# Altium schematic sheet UI_Panel.SchDoc: UI面板
size 297 x 210 mm; Date: 2025/07/10; Author: Leon Lee; CompanyName: 华南理工大学; Organization: 华南理工大学; Address1: 五山路381号; Address2: 天河区，广州市; Address3: 广东省; DocumentNumber: IH2500-08-02; Revision: 1.0; SheetNumber: 2; SheetTotal: 1; Project: IH2500
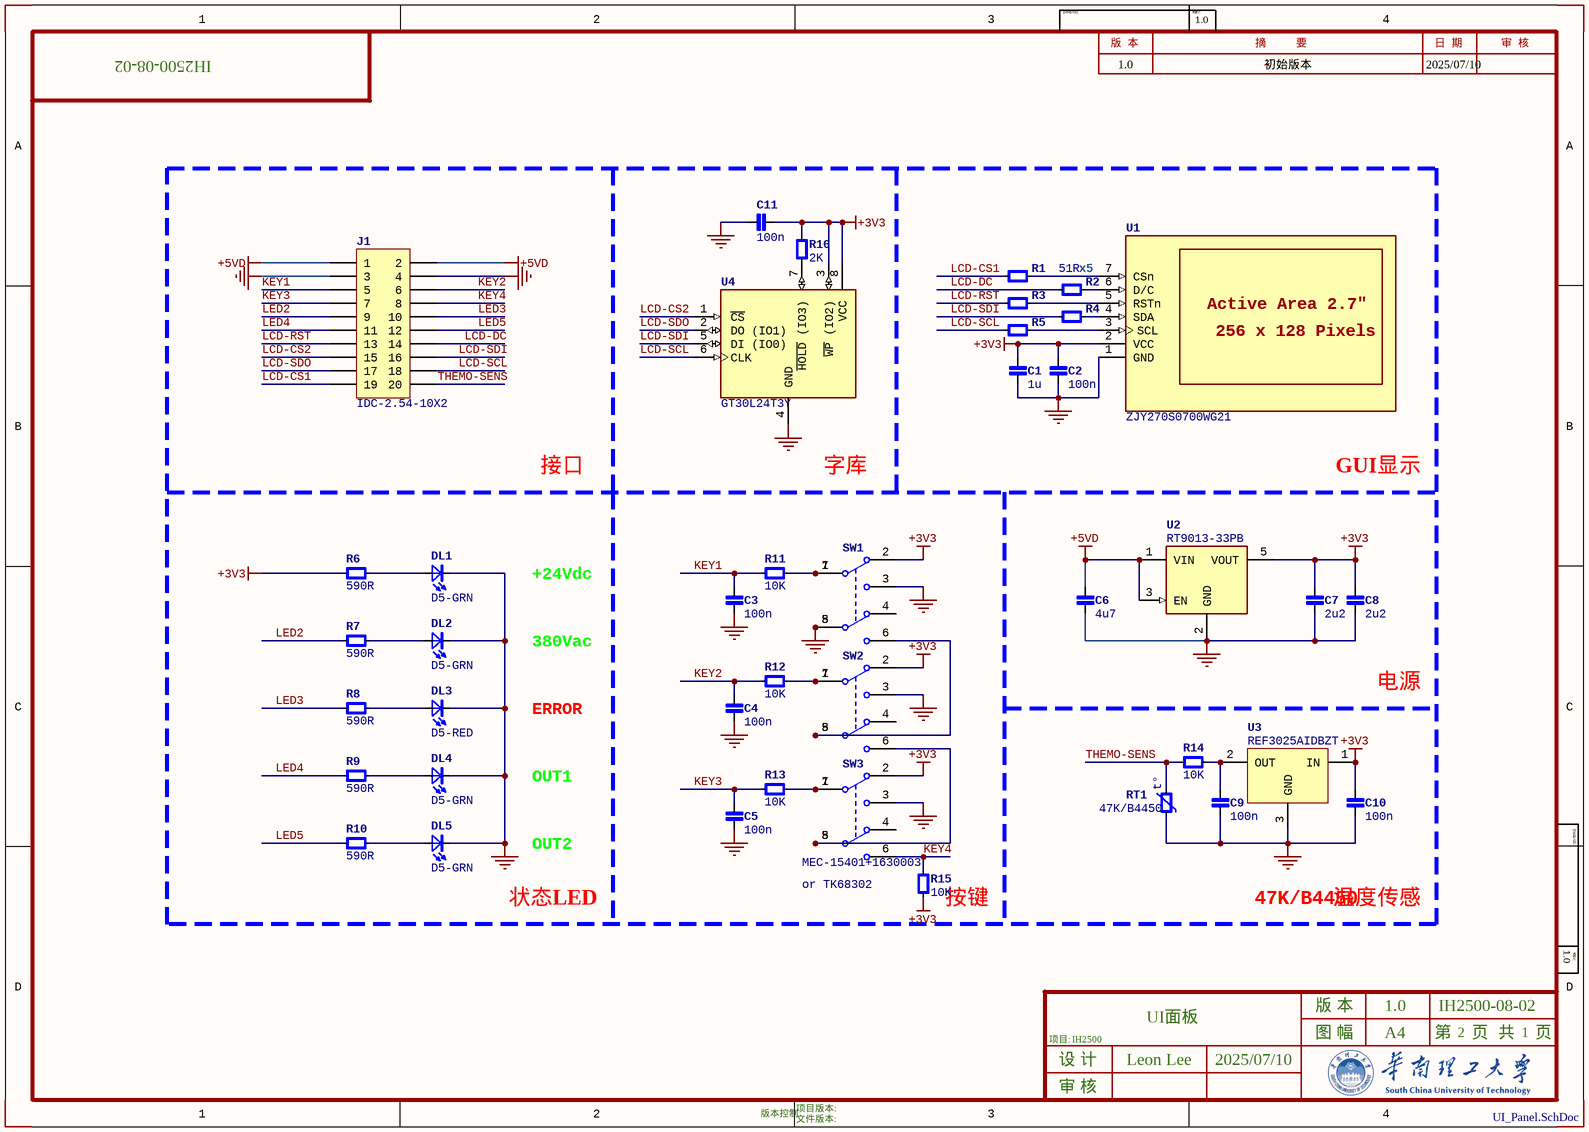
[diagram p0: UI_Panel.SchDoc]

## Parts
C1  1u  [CAPC0805N]
C2  100n  [CAPC0805N]
C3  100n  [CAPC0805N]
C4  100n  [CAPC0805N]
C5  100n  [CAPC0805N]
C6  4u7  [CAPC0805N]
C7  2u2  [CAPC0805N]
C8  2u2  [CAPC0805N]
C9  100n  [CAPC0805N]
C10  100n  [CAPC0805N]
C11  100n  [CAPC0805N]
DL1  D5-GRN  [LED-D5-GRN]
DL2  D5-GRN  [LED-D5-GRN]
DL3  D5-RED  [LED-D5-RED]
DL4  D5-GRN  [LED-D5-GRN]
DL5  D5-GRN  [LED-D5-GRN]
J1  IDC-2.54-10X2  [IDC2.54-V20A]
R1  51R  [RESC0805N]
R2  51R  [RESC0805N]  (value not drawn)
R3  51R  [RESC0805N]  (value not drawn)
R4  51R  [RESC0805N]  (value not drawn)
R5  51R  [RESC0805N]  (value not drawn)
R6  590R  [RESC0805N]
R7  590R  [RESC0805N]
R8  590R  [RESC0805N]
R9  590R  [RESC0805N]
R10  590R  [RESC0805N]
R11  10K  [RESC0805N]
R12  10K  [RESC0805N]
R13  10K  [RESC0805N]
R14  10K  [RESC0805N]
R15  10K  [RESC0805N]
R16  2K  [RESC0805N]
RT1  47K/B4450  [RESC0805N]
SW1  MEC-15401+1630003  [SW-MEC-15xxx]  (value not drawn)
SW2  MEC-15401+1630003  [SW-MEC-15xxx]  (value not drawn)
SW3  MEC-15401+1630003  [SW-MEC-15xxx]
U1  ZJY270S0700WG21  [OLED-2.7-85x50]
U2  RT9013-33PB  [SOT23-5_N]
U3  REF3025AIDBZT  [DBZ0003A_N]
U4  GT30L24T3Y  [SOP127P780-8N]

## Nets
+3V3: C1.1 C2.1 C7.1 C8.1 C10.1 C11.2 R6.1 R15.1 R16.1 SW1.2(NC1) SW2.2(NC1) SW3.2(NC1) U1.2(VCC) U2.5(VOUT) U3.1(IN) U4.3(~{WP}_(IO2)) U4.8(VCC)
+5VD: C6.1 J1.1 J1.2 U2.1(VIN) U2.3(EN)
GND: C1.2 C2.2 C3.2 C4.2 C5.2 C6.2 C7.2 C8.2 C9.2 C10.2 C11.1 DL1.2(K) DL2.2(K) DL3.2(K) DL4.2(K) DL5.2(K) J1.3 J1.4 RT1.1 SW1.3(NO1) SW1.5(COMMON2) SW1.8(COM2) SW2.3(NO1) SW3.3(NO1) U1.1(GND) U2.2(GND) U3.3(GND) U4.4(GND)
KEY1: C3.1 J1.5 R11.1
KEY2: C4.1 J1.6 R12.1
KEY3: C5.1 J1.7 R13.1
KEY4: J1.8 R15.2 SW3.6(NO2)
LCD-CS1: J1.19 R1.1
LCD-CS2: J1.15 U4.1(~{CS})
LCD-DC: J1.14 R2.1
LCD-RST: J1.13 R3.1
LCD-SCL: J1.18 R5.1 U4.6(CLK)
LCD-SDI: J1.16 R4.1 U4.5(DI_(IO0))
LCD-SDO: J1.17 U4.2(DO_(IO1))
LED2: J1.9 R7.1
LED3: J1.10 R8.1
LED4: J1.11 R9.1
LED5: J1.12 R10.1
THEMO-SENS: J1.20 R14.2 RT1.2
NetC9_1: C9.1 R14.1 U3.2(OUT)
NetDL1_1: DL1.1(A) R6.2
NetDL2_1: DL2.1(A) R7.2
NetDL3_1: DL3.1(A) R8.2
NetDL4_1: DL4.1(A) R9.2
NetDL5_1: DL5.1(A) R10.2
NetR1_2: R1.2 U1.7(CSn)
NetR2_2: R2.2 U1.6(D/C)
NetR3_2: R3.2 U1.5(RSTn)
NetR4_2: R4.2 U1.4(SDA)
NetR5_2: R5.2 U1.3(SCL)
NetR11_2: R11.2 SW1.1(COMMON1) SW1.7(COM1)
NetR12_2: R12.2 SW2.1(COMMON1) SW2.7(COM1)
NetR13_2: R13.2 SW3.1(COMMON1) SW3.7(COM1)
NetR16_2: R16.2 U4.7(~{HOLD}_(IO3))
NetSW1_6: SW1.6(NO2) SW2.5(COMMON2) SW2.8(COM2)
NetSW2_6: SW2.6(NO2) SW3.5(COMMON2) SW3.8(COM2)

Not connected (* = marked no-connect by the designer): SW1 4(NC2); SW2 4(NC2); SW3 4(NC2)

## Notes on the sheet
- 1.0
- 初始版本
- 2025/07/10
- (near R2) x5
- 接口
- 字库
- GUI显示
- +24Vdc
- 380Vac
- 电源
- ERROR
- OUT1
- OUT2
- (near SW3) or TK68302
- 状态LED
- (near R15) 按键
- 47K/B4450
- 温度传感
- DWG NO:
- 版  本
- REV:
- 摘          要
- 日  期
- 审  核
- 版 本
- 项目:
- 设 计
- 审 核
- 图 幅
- A4
- 第
- 页
- 共
- 版本控制
- 项目版本:
- 文件版本:
- (in symbol OLED-ZJY270S0700) Active Area 2.7"; 256 x 128 Pixels
- (in symbol RESISTOR(S) Thermal) t°

## Library data of the parts
C1-C11 = CAPACITOR(S): 名称: 贴片陶瓷电容; 代号: C; 型号: X7R-0805-50V-10%; 备注: X7R/X5R系列
DL1 DL2 DL4 DL5 = LED(S): 发光二极管; 代号: DL; 型号: D5-绿色; 备注: 雾状圆头; 名称: 发光二极管
DL3 = LED(S): 发光二极管; 代号: DL; 型号: D5-红色; 备注: 雾状圆头; 名称: 发光二极管
J1 = Header 10X2: Header, 10-Pin, Dual row; 代号: J; 名称: 接插件; 备注: 直插，针，带牛角; LatestRevisionDate: 17-Jul-2002; LatestRevisionNote: Re-released for DXP Platform.; Publisher: Altium Limited; 型号: IDC-2.54-10x2
R1-R13 R15 = RESISTOR(S): 电阻; 代号: R; 名称: 贴片电阻; 型号: CR-0805-1%
R14 R16 = RESISTOR(S): 名称: 贴片电阻; 代号: R; 型号: CR-0805-1%
RT1 = RESISTOR(S) Thermal: 热敏电阻; 名称: 贴片NTC电阻; 代号: P; 型号: 47K-B4450-0805
SW1-SW3 = SW DPDT: Switch; pin to pad: 3>4 4>8 7>3 8>7; 代号: SW; 名称: 按键开关; Published: 24-Mar-1999; LatestRevisionDate: 29-May-2009; LatestRevisionNote: IPC-7351 Footprint Added.; PackageVersion: Mar-2001; PackageReference: SOT23-6; Publisher: Altium Limited; PackageDescription: 6-Pin SOT-23 Package 0.95 mm Pitch, 2.7 mm Lead Span; Code_JEITA: SC-74; Code_IPC: SOT26A-6; 型号: MEC-15401+1630003
U1 = OLED-ZJY270S0700: 中景园，ZJY270S0700YG21/WG21 OLED显示模组，256x128像素，16级灰度，SSD1363控制器，YG-黄色，WG-白色; 代号: U; 名称: 显示模组; 备注: 中景园，2.7寸，256x128，白色; 型号: ZJY270S0700WG21
U2 = RT9013-xxPB: 500mA, Low Dropout, Low Noise Ultra-Fast Without Bypass Capacitor CMOS LDO Regulator; 代号: U; 名称: 贴片集成电路; 型号: RT9013-33PB
U3 = CMP-0367-00150-2: 2.5 V, 50 ppm / degC, 50 uA Series (Bandgap) Voltage Reference, -40 to 125 degC, 3-pin SOT-23 (DBZ), Green (RoHS & no Sb/Br); Manufacturer: Texas Instruments; VI(Min)(V): 2.501; Initial Accuracy @ 25/deg C(%): 0.2; Rating: Catalog; VO(V): 2.5; Iq(Max)(uA): 50; Temp Coeff(Typ)(ppm/ degree C): 20; SubFamily: Series Voltage Reference; VI(Max)(V): 5.5; 代号: U; 名称: 贴片集成电路; ComponentLink4Description: URL Link1; PartNumber: REF3025AIDBZT; ComponentLink1URL: http://www.ti.com/; Eco-Plan: Green (RoHS & no Sb/Br); ComponentLink3URL: http://www.ti.com/litv/pdf/mpds108a; Mounting Technology: Surface Mount; ComponentLink3Description: Package Specification; PackageDescription: 3-Pin Plastic Small Outline, Body 2.92 x 1.3 mm, Pitch 0.95 mm; PackageReference: DBZ0003A; Code_JEDEC: TO-236; Temp Coeff(Max)(ppm/ degree C): 50; ComponentLink4URL: Samples URL:http://www.ti.com/product/ref3025; ComponentLink2Description: Datasheet; ComponentLink2URL: http://www.ti.com/general/docs/lit/getliterature.tsp?genericPartNumber=REF3025&fileType=pdf; PackageVersion: 4203227/B; ComponentLink1Description: Manufacturer URL; DatasheetVersion: SBVS032F; 型号: REF3025AIDBZT
U4 = WINB-W25Q40CL-SOIC-8: 代号: U; 名称: 贴片集成电路; 型号: GT30L24T3Y